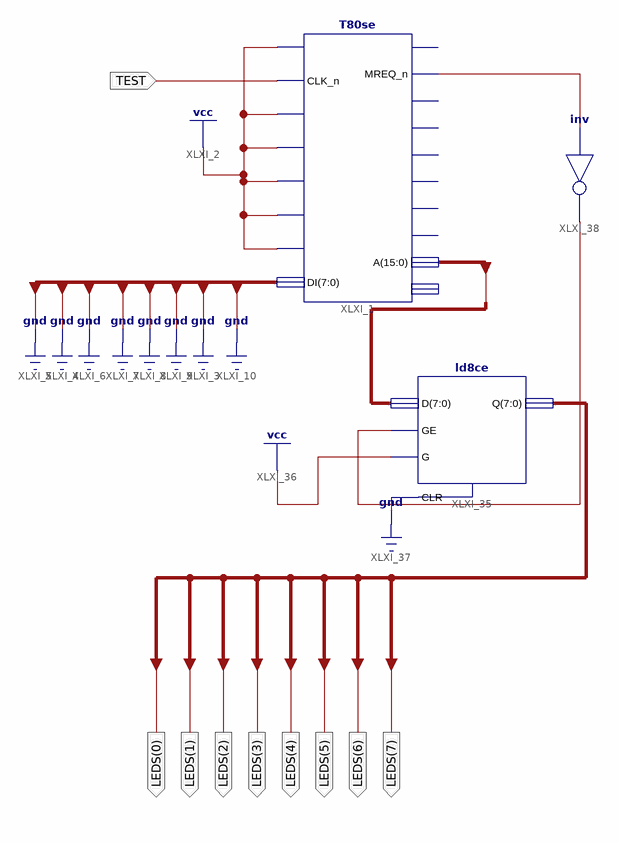
[diagram p0: schematic sheet 1]
// Xilinx ISE schematic Z80_adresses_test.sch (spartan3) as structural Verilog: 3 symbols, 9 ports
module Z80_adresses_test (
  input  TEST,
  output [7:0] LEDS
);

  wire XLXN_97, XLXN_98;
  wire [15:0] ADRESSES;

  not XLXI_38 (XLXN_98, XLXN_97);
  T80se XLXI_1 (
    .RESET_n(1'b1), .CLK_n(TEST), .CLKEN(1'b1), .WAIT_n(1'b1), .INT_n(1'b1), .NMI_n(1'b1), .BUSRQ_n(1'b1),
    .DI({8{1'b0}}), .MREQ_n(XLXN_97), .A(ADRESSES));  // open: M1_n, IORQ_n, RD_n, WR_n, RFSH_n, HALT_n, BUSAK_n, DO
  ld8ce XLXI_35 (.CLR(1'b0), .D(ADRESSES[7:0]), .G(1'b1), .GE(XLXN_98), .Q(LEDS));
endmodule
